# EasyEDA Pro project EasyEda.epro, schematic Schematic

## Sheets
1 Main: Board Name: General; Create Date: 2025-05-29; Page Name: Main; Project Name: TSC Tiwaz; Schematic Name: Schematic; Update Date: 2026-05-17; Company: TimoStrube.de; Drawn: Timo; Page Size: A4; Reviewed: Timo; Version: v1.3
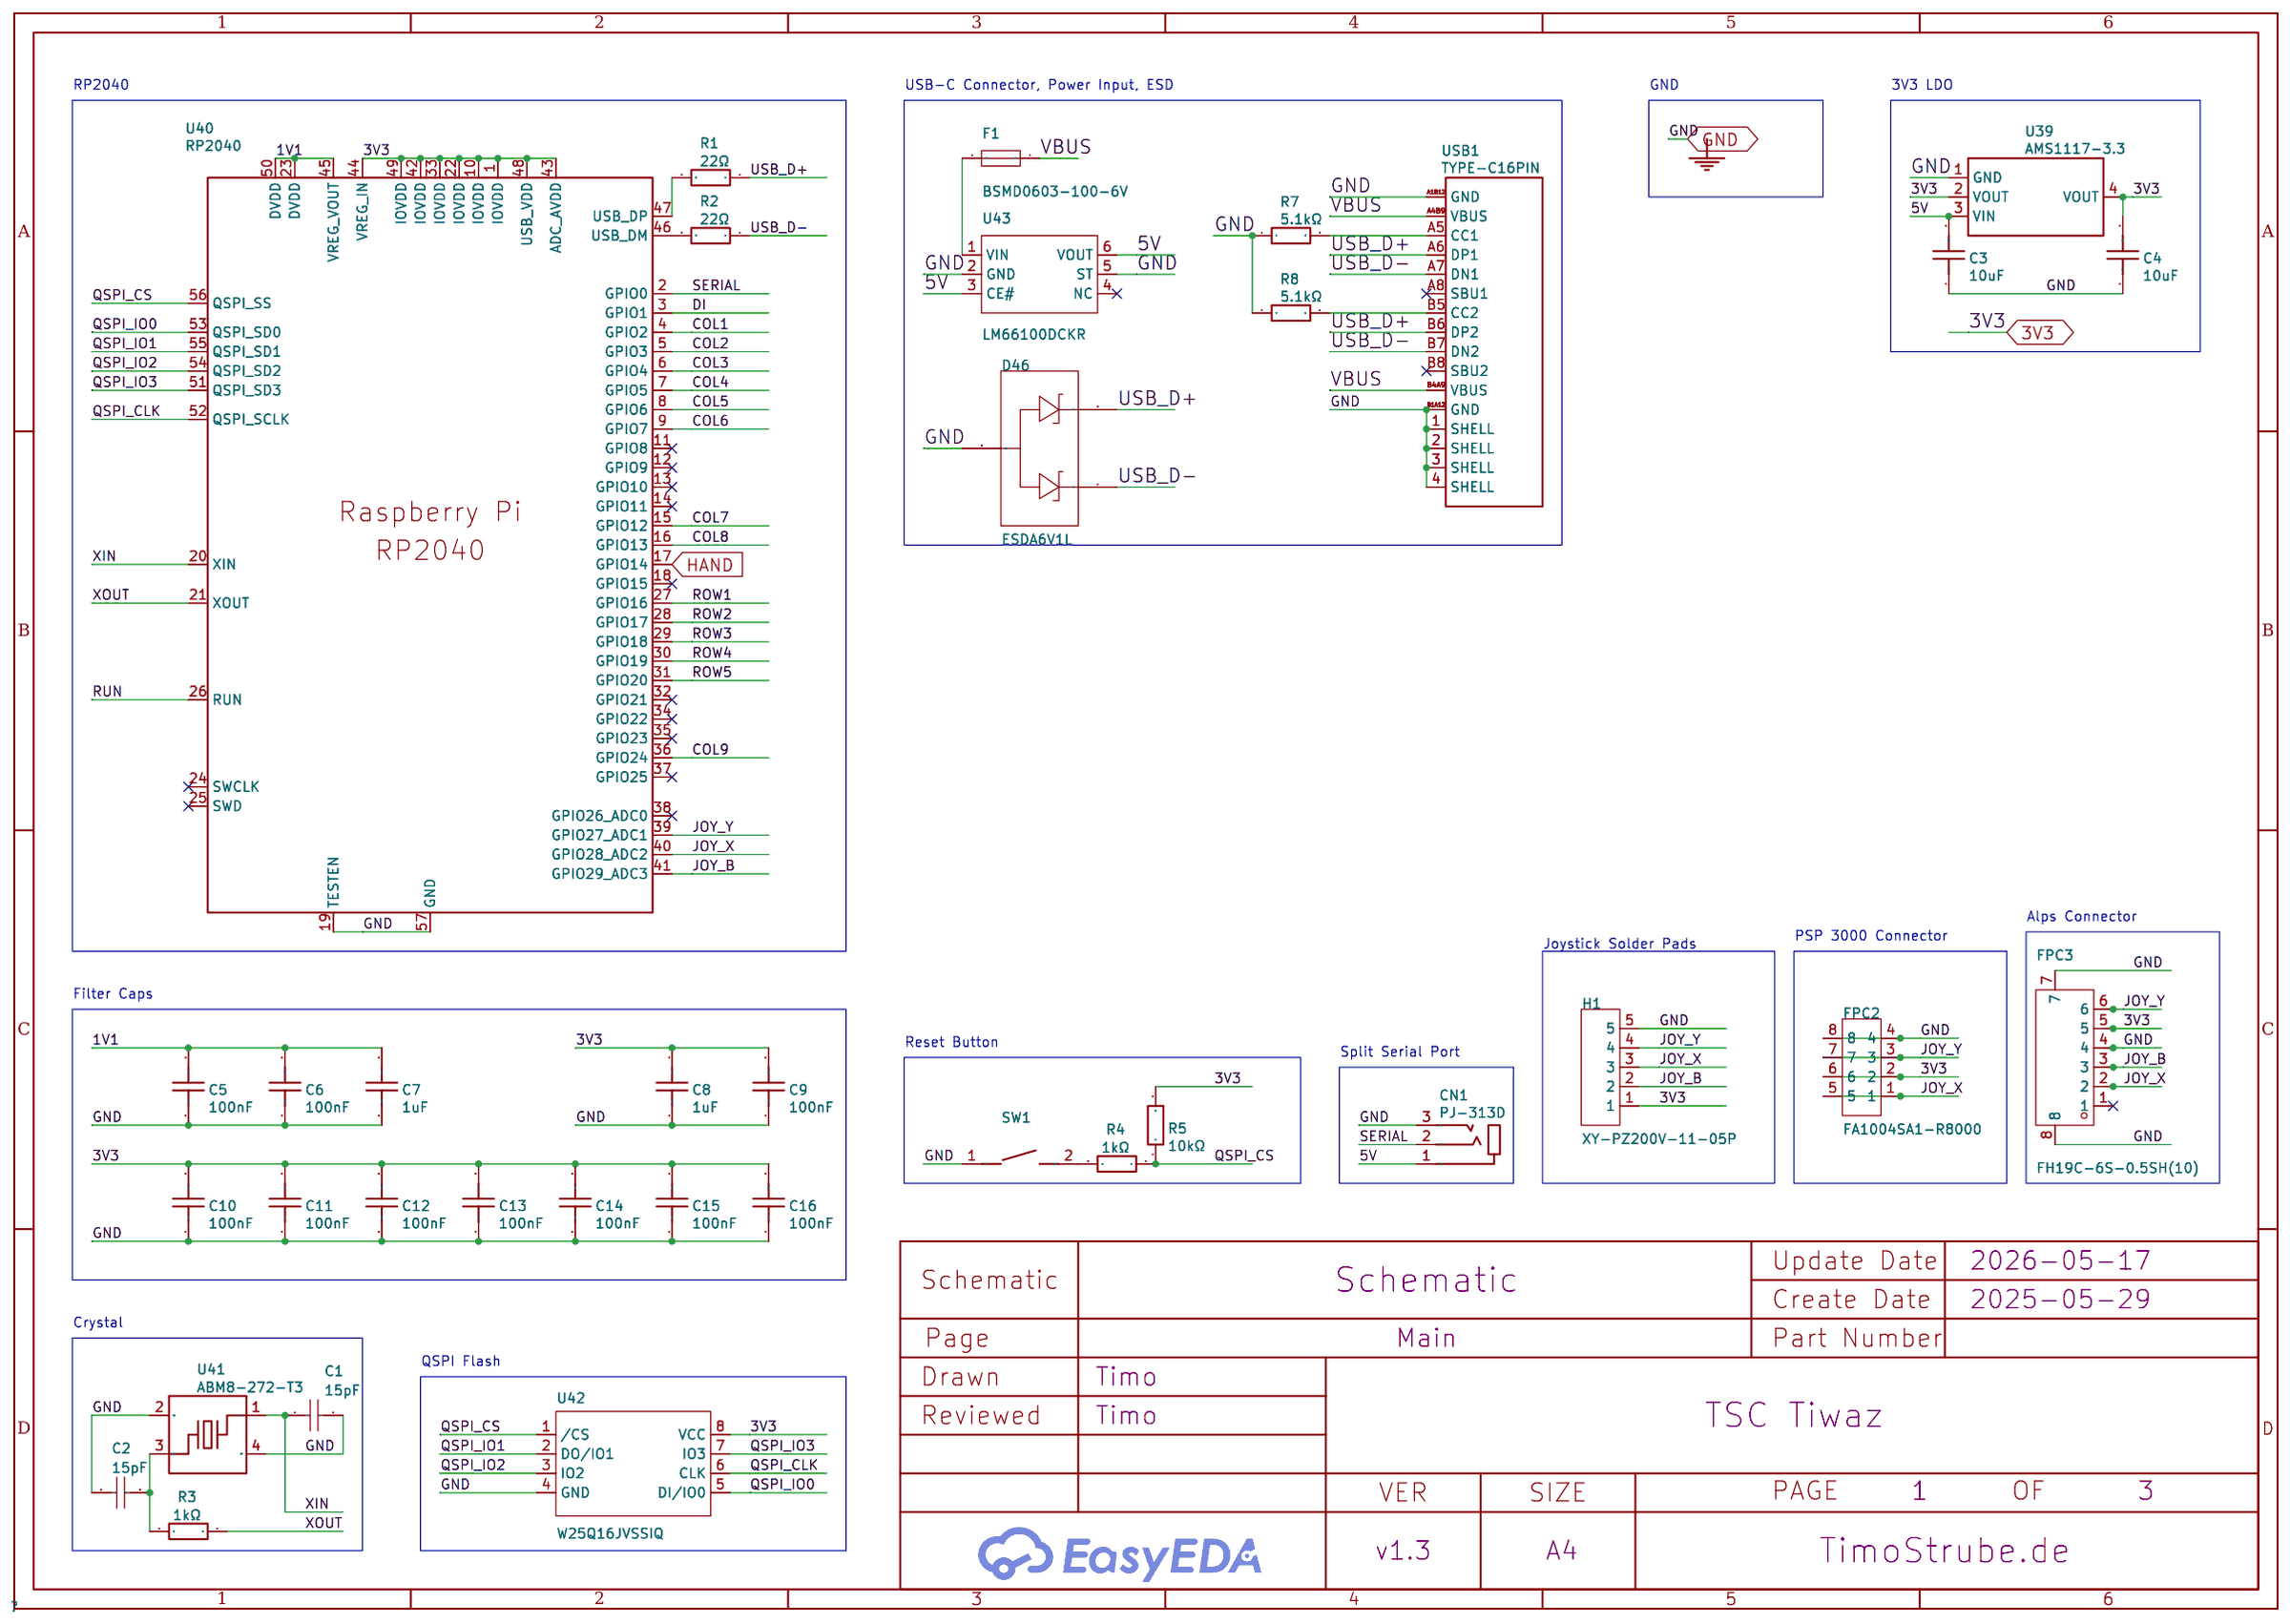
[diagram p2: Main]
2 LEDs: Create Date: 2025-06-02; Page Name: LEDs; Project Name: Splitto Dogu 2; Update Date: 2026-04-11
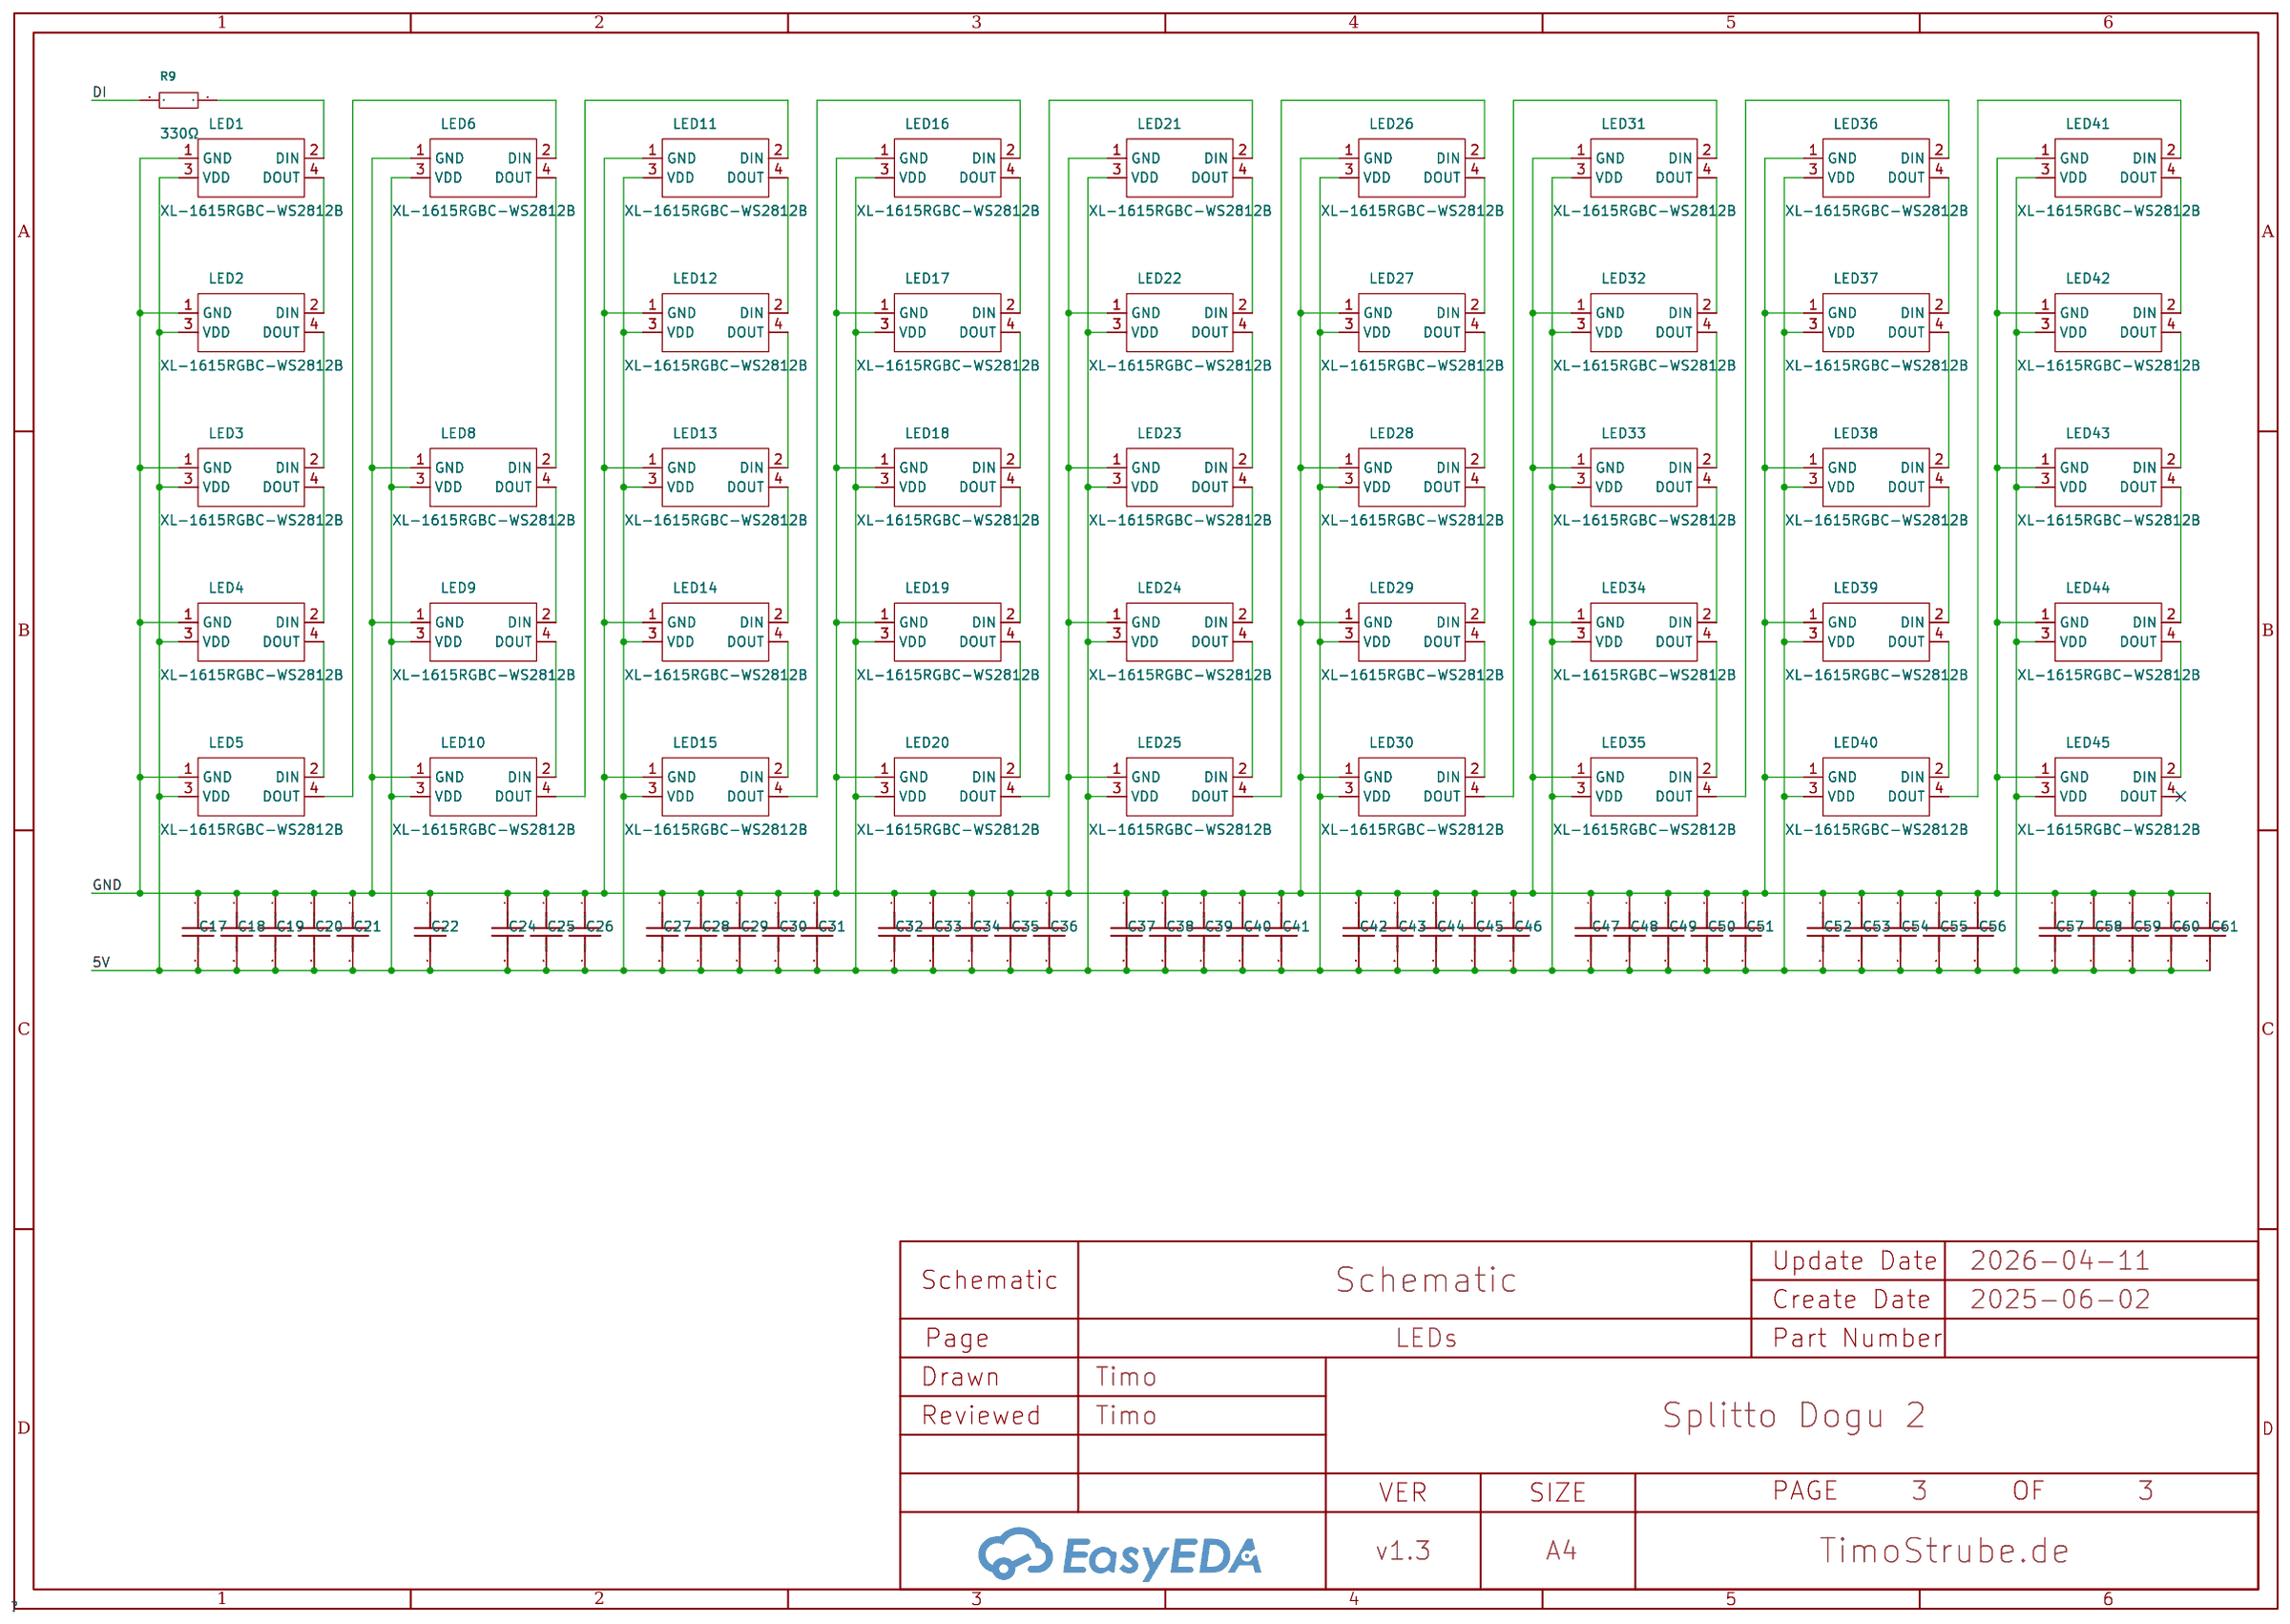
[diagram p3: LEDs]
3 Switches: Create Date: 2025-06-02; Page Name: Switches; Project Name: Splitto Dogu 2; Update Date: 2026-04-11
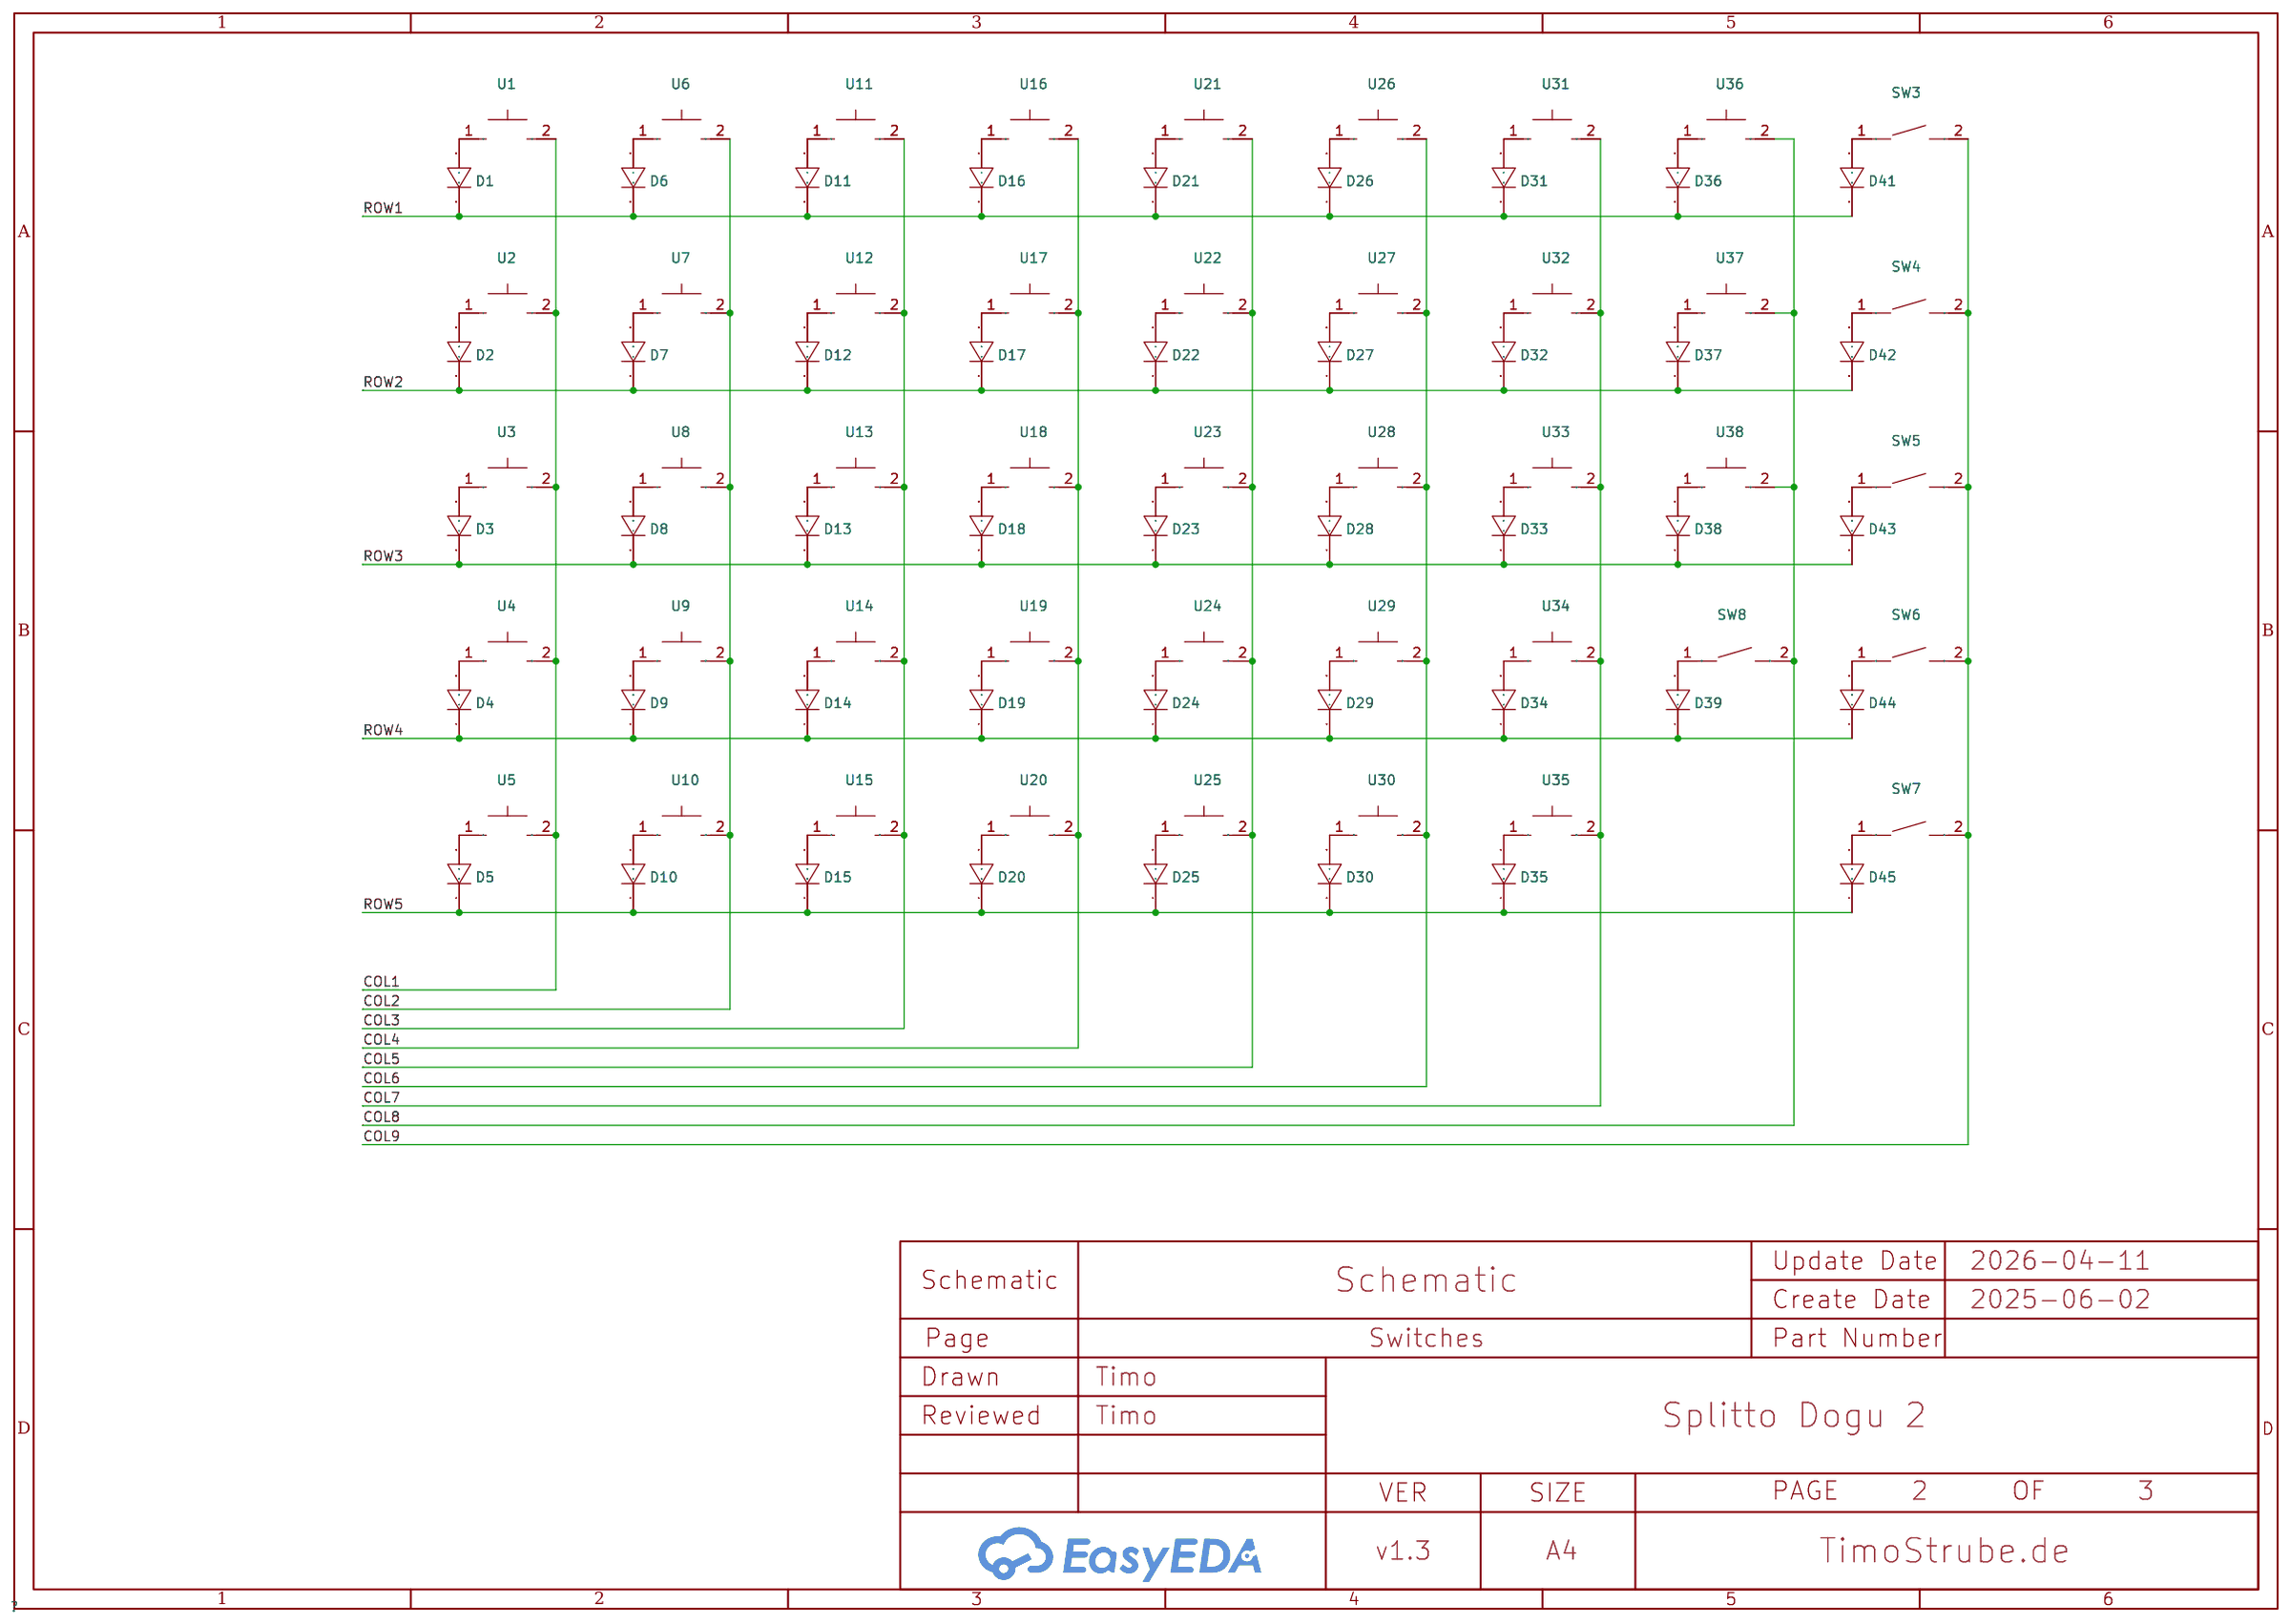
[diagram p4: Switches]

## Parts
sheet LEDs
C17  100nF  [C0402]
C18  100nF  [C0402]
C19  100nF  [C0402]
C20  100nF  [C0402]
C21  100nF  [C0402]
C22  100nF  [C0402]
C24  100nF  [C0402]
C25  100nF  [C0402]
C26  100nF  [C0402]
C27  100nF  [C0402]
C28  100nF  [C0402]
C29  100nF  [C0402]
C30  100nF  [C0402]
C31  100nF  [C0402]
C32  100nF  [C0402]
C33  100nF  [C0402]
C34  100nF  [C0402]
C35  100nF  [C0402]
C36  100nF  [C0402]
C37  100nF  [C0402]
C38  100nF  [C0402]
C39  100nF  [C0402]
C40  100nF  [C0402]
C41  100nF  [C0402]
C42  100nF  [C0402]
C43  100nF  [C0402]
C44  100nF  [C0402]
C45  100nF  [C0402]
C46  100nF  [C0402]
C47  100nF  [C0402]
C48  100nF  [C0402]
C49  100nF  [C0402]
C50  100nF  [C0402]
C51  100nF  [C0402]
C52  100nF  [C0402]
C53  100nF  [C0402]
C54  100nF  [C0402]
C55  100nF  [C0402]
C56  100nF  [C0402]
C57  100nF  [C0402]
C58  100nF  [C0402]
C59  100nF  [C0402]
C60  100nF  [C0402]
C61  100nF  [C0402]
LED1  XL-1615RGBC-WS2812B  [LED-SMD_4P-L1.6-W1.5_XL-1615RGBC-WS2812B-1]
LED2  XL-1615RGBC-WS2812B  [LED-SMD_4P-L1.6-W1.5_XL-1615RGBC-WS2812B-1]
LED3  XL-1615RGBC-WS2812B  [LED-SMD_4P-L1.6-W1.5_XL-1615RGBC-WS2812B-1]
LED4  XL-1615RGBC-WS2812B  [LED-SMD_4P-L1.6-W1.5_XL-1615RGBC-WS2812B-1]
LED5  XL-1615RGBC-WS2812B  [LED-SMD_4P-L1.6-W1.5_XL-1615RGBC-WS2812B-1]
LED6  XL-1615RGBC-WS2812B  [LED-SMD_4P-L1.6-W1.5_XL-1615RGBC-WS2812B-1]
LED8  XL-1615RGBC-WS2812B  [LED-SMD_4P-L1.6-W1.5_XL-1615RGBC-WS2812B-1]
LED9  XL-1615RGBC-WS2812B  [LED-SMD_4P-L1.6-W1.5_XL-1615RGBC-WS2812B-1]
LED10  XL-1615RGBC-WS2812B  [LED-SMD_4P-L1.6-W1.5_XL-1615RGBC-WS2812B-1]
LED11  XL-1615RGBC-WS2812B  [LED-SMD_4P-L1.6-W1.5_XL-1615RGBC-WS2812B-1]
LED12  XL-1615RGBC-WS2812B  [LED-SMD_4P-L1.6-W1.5_XL-1615RGBC-WS2812B-1]
LED13  XL-1615RGBC-WS2812B  [LED-SMD_4P-L1.6-W1.5_XL-1615RGBC-WS2812B-1]
LED14  XL-1615RGBC-WS2812B  [LED-SMD_4P-L1.6-W1.5_XL-1615RGBC-WS2812B-1]
LED15  XL-1615RGBC-WS2812B  [LED-SMD_4P-L1.6-W1.5_XL-1615RGBC-WS2812B-1]
LED16  XL-1615RGBC-WS2812B  [LED-SMD_4P-L1.6-W1.5_XL-1615RGBC-WS2812B-1]
LED17  XL-1615RGBC-WS2812B  [LED-SMD_4P-L1.6-W1.5_XL-1615RGBC-WS2812B-1]
LED18  XL-1615RGBC-WS2812B  [LED-SMD_4P-L1.6-W1.5_XL-1615RGBC-WS2812B-1]
LED19  XL-1615RGBC-WS2812B  [LED-SMD_4P-L1.6-W1.5_XL-1615RGBC-WS2812B-1]
LED20  XL-1615RGBC-WS2812B  [LED-SMD_4P-L1.6-W1.5_XL-1615RGBC-WS2812B-1]
LED21  XL-1615RGBC-WS2812B  [LED-SMD_4P-L1.6-W1.5_XL-1615RGBC-WS2812B-1]
LED22  XL-1615RGBC-WS2812B  [LED-SMD_4P-L1.6-W1.5_XL-1615RGBC-WS2812B-1]
LED23  XL-1615RGBC-WS2812B  [LED-SMD_4P-L1.6-W1.5_XL-1615RGBC-WS2812B-1]
LED24  XL-1615RGBC-WS2812B  [LED-SMD_4P-L1.6-W1.5_XL-1615RGBC-WS2812B-1]
LED25  XL-1615RGBC-WS2812B  [LED-SMD_4P-L1.6-W1.5_XL-1615RGBC-WS2812B-1]
LED26  XL-1615RGBC-WS2812B  [LED-SMD_4P-L1.6-W1.5_XL-1615RGBC-WS2812B-1]
LED27  XL-1615RGBC-WS2812B  [LED-SMD_4P-L1.6-W1.5_XL-1615RGBC-WS2812B-1]
LED28  XL-1615RGBC-WS2812B  [LED-SMD_4P-L1.6-W1.5_XL-1615RGBC-WS2812B-1]
LED29  XL-1615RGBC-WS2812B  [LED-SMD_4P-L1.6-W1.5_XL-1615RGBC-WS2812B-1]
LED30  XL-1615RGBC-WS2812B  [LED-SMD_4P-L1.6-W1.5_XL-1615RGBC-WS2812B-1]
LED31  XL-1615RGBC-WS2812B  [LED-SMD_4P-L1.6-W1.5_XL-1615RGBC-WS2812B-1]
LED32  XL-1615RGBC-WS2812B  [LED-SMD_4P-L1.6-W1.5_XL-1615RGBC-WS2812B-1]
LED33  XL-1615RGBC-WS2812B  [LED-SMD_4P-L1.6-W1.5_XL-1615RGBC-WS2812B-1]
LED34  XL-1615RGBC-WS2812B  [LED-SMD_4P-L1.6-W1.5_XL-1615RGBC-WS2812B-1]
LED35  XL-1615RGBC-WS2812B  [LED-SMD_4P-L1.6-W1.5_XL-1615RGBC-WS2812B-1]
LED36  XL-1615RGBC-WS2812B  [LED-SMD_4P-L1.6-W1.5_XL-1615RGBC-WS2812B-1]
LED37  XL-1615RGBC-WS2812B  [LED-SMD_4P-L1.6-W1.5_XL-1615RGBC-WS2812B-1]
LED38  XL-1615RGBC-WS2812B  [LED-SMD_4P-L1.6-W1.5_XL-1615RGBC-WS2812B-1]
LED39  XL-1615RGBC-WS2812B  [LED-SMD_4P-L1.6-W1.5_XL-1615RGBC-WS2812B-1]
LED40  XL-1615RGBC-WS2812B  [LED-SMD_4P-L1.6-W1.5_XL-1615RGBC-WS2812B-1]
LED41  XL-1615RGBC-WS2812B  [LED-SMD_4P-L1.6-W1.5_XL-1615RGBC-WS2812B-1]
LED42  XL-1615RGBC-WS2812B  [LED-SMD_4P-L1.6-W1.5_XL-1615RGBC-WS2812B-1]
LED43  XL-1615RGBC-WS2812B  [LED-SMD_4P-L1.6-W1.5_XL-1615RGBC-WS2812B-1]
LED44  XL-1615RGBC-WS2812B  [LED-SMD_4P-L1.6-W1.5_XL-1615RGBC-WS2812B-1]
LED45  XL-1615RGBC-WS2812B  [LED-SMD_4P-L1.6-W1.5_XL-1615RGBC-WS2812B-1]
R9  330Ω  [R0402]
sheet Main
C1  15pF  [C0402]
C2  15pF  [C0402]
C3  10uF  [C0603]
C4  10uF  [C0603]
C5  100nF  [C0402]
C6  100nF  [C0402]
C7  1uF  [C0402]
C8  1uF  [C0402]
C9  100nF  [C0402]
C10  100nF  [C0402]
C11  100nF  [C0402]
C12  100nF  [C0402]
C13  100nF  [C0402]
C14  100nF  [C0402]
C15  100nF  [C0402]
C16  100nF  [C0402]
CN1  PJ-313D  [AUDIO-SMD_PJ-313D-2]
D46  ESDA6V1L  [SOT-23-3_L3.0-W1.7-P0.95-LS2.9-BR]
F1  BSMD0603-100-6V  [F0603]
FPC2  FA1004SA1-R8000  [CONN-SMD_FA1004SA1-R8000]
FPC3  FH19C-6S-0.5SH(10)  [FPC-SMD_FH19C-6S-0.5SH]
H1  XY-PZ200V-11-05P  [HDR-TH_XY-PZ200V-11-05P]
R1  22Ω  [R0402]
R2  22Ω  [R0402]
R3  1kΩ  [R0402]
R4  1kΩ  [R0402]
R5  10kΩ  [R0402]
R7  5.1kΩ  [R0402]
R8  5.1kΩ  [R0402]
SW1  TS-1088-AR02016  [SW-SMD_L3.9-W3.0-P4.45]
U39  AMS1117-3.3  [SOT-223-3_L6.5-W3.4-P2.30-LS7.0-BR]
U40  RP2040  [LQFN-56_L7.0-W7.0-P0.4-EP]
U41  ABM8-272-T3  [CRYSTAL-SMD_4P-L3.2-W2.5-BL]
U42  W25Q16JVSSIQ  [SOIC-8_L5.3-W5.3-P1.27-LS8.0-BL]
U43  LM66100DCKR  [SC-70-6_L2.0-W1.3-P0.65-LS2.1-BL]
USB1  TYPE-C16PIN  [USB-C-SMD_TYPE-C16PIN]
sheet Switches
D1  1N4148WS  [SOD-323_L1.8-W1.3-LS2.5-RD]
D2  1N4148WS  [SOD-323_L1.8-W1.3-LS2.5-RD]
D3  1N4148WS  [SOD-323_L1.8-W1.3-LS2.5-RD]
D4  1N4148WS  [SOD-323_L1.8-W1.3-LS2.5-RD]
D5  1N4148WS  [SOD-323_L1.8-W1.3-LS2.5-RD]
D6  1N4148WS  [SOD-323_L1.8-W1.3-LS2.5-RD]
D7  1N4148WS  [SOD-323_L1.8-W1.3-LS2.5-RD]
D8  1N4148WS  [SOD-323_L1.8-W1.3-LS2.5-RD]
D9  1N4148WS  [SOD-323_L1.8-W1.3-LS2.5-RD]
D10  1N4148WS  [SOD-323_L1.8-W1.3-LS2.5-RD]
D11  1N4148WS  [SOD-323_L1.8-W1.3-LS2.5-RD]
D12  1N4148WS  [SOD-323_L1.8-W1.3-LS2.5-RD]
D13  1N4148WS  [SOD-323_L1.8-W1.3-LS2.5-RD]
D14  1N4148WS  [SOD-323_L1.8-W1.3-LS2.5-RD]
D15  1N4148WS  [SOD-323_L1.8-W1.3-LS2.5-RD]
D16  1N4148WS  [SOD-323_L1.8-W1.3-LS2.5-RD]
D17  1N4148WS  [SOD-323_L1.8-W1.3-LS2.5-RD]
D18  1N4148WS  [SOD-323_L1.8-W1.3-LS2.5-RD]
D19  1N4148WS  [SOD-323_L1.8-W1.3-LS2.5-RD]
D20  1N4148WS  [SOD-323_L1.8-W1.3-LS2.5-RD]
D21  1N4148WS  [SOD-323_L1.8-W1.3-LS2.5-RD]
D22  1N4148WS  [SOD-323_L1.8-W1.3-LS2.5-RD]
D23  1N4148WS  [SOD-323_L1.8-W1.3-LS2.5-RD]
D24  1N4148WS  [SOD-323_L1.8-W1.3-LS2.5-RD]
D25  1N4148WS  [SOD-323_L1.8-W1.3-LS2.5-RD]
D26  1N4148WS  [SOD-323_L1.8-W1.3-LS2.5-RD]
D27  1N4148WS  [SOD-323_L1.8-W1.3-LS2.5-RD]
D28  1N4148WS  [SOD-323_L1.8-W1.3-LS2.5-RD]
D29  1N4148WS  [SOD-323_L1.8-W1.3-LS2.5-RD]
D30  1N4148WS  [SOD-323_L1.8-W1.3-LS2.5-RD]
D31  1N4148WS  [SOD-323_L1.8-W1.3-LS2.5-RD]
D32  1N4148WS  [SOD-323_L1.8-W1.3-LS2.5-RD]
D33  1N4148WS  [SOD-323_L1.8-W1.3-LS2.5-RD]
D34  1N4148WS  [SOD-323_L1.8-W1.3-LS2.5-RD]
D35  1N4148WS  [SOD-323_L1.8-W1.3-LS2.5-RD]
D36  1N4148WS  [SOD-323_L1.8-W1.3-LS2.5-RD]
D37  1N4148WS  [SOD-323_L1.8-W1.3-LS2.5-RD]
D38  1N4148WS  [SOD-323_L1.8-W1.3-LS2.5-RD]
D39  1N4148WS  [SOD-323_L1.8-W1.3-LS2.5-RD]
D41  1N4148WS  [SOD-323_L1.8-W1.3-LS2.5-RD]
D42  1N4148WS  [SOD-323_L1.8-W1.3-LS2.5-RD]
D43  1N4148WS  [SOD-323_L1.8-W1.3-LS2.5-RD]
D44  1N4148WS  [SOD-323_L1.8-W1.3-LS2.5-RD]
D45  1N4148WS  [SOD-323_L1.8-W1.3-LS2.5-RD]
SW3  TS-1088-AR02016  [SW-SMD_L3.9-W3.0-P4.45]
SW4  TS-1088-AR02016  [SW-SMD_L3.9-W3.0-P4.45]
SW5  TS-1088-AR02016  [SW-SMD_L3.9-W3.0-P4.45]
SW6  TS-1088-AR02016  [SW-SMD_L3.9-W3.0-P4.45]
SW7  TS-1088-AR02016  [SW-SMD_L3.9-W3.0-P4.45]
SW8  TS-1088-AR02016  [SW-SMD_L3.9-W3.0-P4.45]
U1  CPG151101S11-16  [SMD_KEYBOARD-SW_COMPLETE]
U2  CPG151101S11-16  [SMD_KEYBOARD-SW_COMPLETE]
U3  CPG151101S11-16  [SMD_KEYBOARD-SW_COMPLETE]
U4  CPG151101S11-16  [SMD_KEYBOARD-SW_COMPLETE]
U5  CPG151101S11-16  [SMD_KEYBOARD-SW_COMPLETE]
U6  CPG151101S11-16  [SMD_KEYBOARD-SW_COMPLETE]
U7  CPG151101S11-16  [SMD_KEYBOARD-SW_COMPLETE]
U8  CPG151101S11-16  [SMD_KEYBOARD-SW_COMPLETE]
U9  CPG151101S11-16  [SMD_KEYBOARD-SW_COMPLETE]
U10  CPG151101S11-16  [SMD_KEYBOARD-SW_COMPLETE]
U11  CPG151101S11-16  [SMD_KEYBOARD-SW_COMPLETE]
U12  CPG151101S11-16  [SMD_KEYBOARD-SW_COMPLETE]
U13  CPG151101S11-16  [SMD_KEYBOARD-SW_COMPLETE]
U14  CPG151101S11-16  [SMD_KEYBOARD-SW_COMPLETE]
U15  CPG151101S11-16  [SMD_KEYBOARD-SW_COMPLETE]
U16  CPG151101S11-16  [SMD_KEYBOARD-SW_COMPLETE]
U17  CPG151101S11-16  [SMD_KEYBOARD-SW_COMPLETE]
U18  CPG151101S11-16  [SMD_KEYBOARD-SW_COMPLETE]
U19  CPG151101S11-16  [SMD_KEYBOARD-SW_COMPLETE]
U20  CPG151101S11-16  [SMD_KEYBOARD-SW_COMPLETE]
U21  CPG151101S11-16  [SMD_KEYBOARD-SW_COMPLETE]
U22  CPG151101S11-16  [SMD_KEYBOARD-SW_COMPLETE]
U23  CPG151101S11-16  [SMD_KEYBOARD-SW_COMPLETE]
U24  CPG151101S11-16  [SMD_KEYBOARD-SW_COMPLETE]
U25  CPG151101S11-16  [SMD_KEYBOARD-SW_COMPLETE]
U26  CPG151101S11-16  [SMD_KEYBOARD-SW_COMPLETE]
U27  CPG151101S11-16  [SMD_KEYBOARD-SW_COMPLETE]
U28  CPG151101S11-16  [SMD_KEYBOARD-SW_COMPLETE]
U29  CPG151101S11-16  [SMD_KEYBOARD-SW_COMPLETE]
U30  CPG151101S11-16  [SMD_KEYBOARD-SW_COMPLETE]
U31  CPG151101S11-16  [SMD_KEYBOARD-SW_COMPLETE]
U32  CPG151101S11-16  [SMD_KEYBOARD-SW_COMPLETE]
U33  CPG151101S11-16  [SMD_KEYBOARD-SW_COMPLETE]
U34  CPG151101S11-16  [SMD_KEYBOARD-SW_COMPLETE]
U35  CPG151101S11-16  [SMD_KEYBOARD-SW_COMPLETE]
U36  CPG151101S11-16  [SMD_KEYBOARD-SW_COMPLETE]
U37  CPG151101S11-16  [SMD_KEYBOARD-SW_COMPLETE]
U38  CPG151101S11-16  [SMD_KEYBOARD-SW_COMPLETE]

## Library data of the parts
C5 C6 C9-C22 C24-C61 = 100nF: Supplier: LCSC; Manufacturer: SAMSUNG(三星); Manufacturer Part: CL05B104KO5NNNC; Supplier Part: C1525; JLCPCB Part Class: Basic Part; nameAlias: Value; spicePre: C; spiceSymbolName: CL05B104KO5NNNC
LED1-LED6 LED8-LED45 = XL-1615RGBC-WS2812B: Wavelength:620nm~625nm；525nm~530nm；465nm~470nm Luminous Intensity:360mcd；110mcd；130mcd Lens Color:Colorless Transparent Lens Installation method:Positive Stick Operating Temperature:-20℃~+85℃; LCSC Part Name: 幻彩透明 XL-1615RGBC-WS2812B; Supplier Part: C5349954; Manufacturer: XINGLIGHT(成兴光); Supplier Footprint: SMD-4P,1.6x1.5mm; JLCPCB Part Class: Extended Part; Datasheet: https://atta.szlcsc.com/upload/public/pdf/source/20250225/67A3F398505C98A70638B14BC571D0AB.pdf; Supplier: LCSC; Wavelength: 620nm~625nm；525nm~530nm；465nm~470nm; Luminous Intensity: 360mcd；110mcd；130mcd; Lens Color: Colorless Transparent Lens; Installation method: Positive Stick; Operating Temperature: -20℃~+85℃
R9 = 0402WGF3300TCE: Type:Thick Film Resistors Resistance:330Ω Tolerance:±1% Tolerance:±1% Power(Watts):1/16W Voltage-Supply(Max):50V Temperature Coefficient:±100ppm/℃ Temperature Coefficient:±100ppm/℃ Operating Temperature:-55℃~+155℃ Operating Temperature:-55℃~+155℃; LCSC Part Name: 330Ω ±1% 62.5mW 厚膜电阻; Supplier Part: C25104; Manufacturer: UNI-ROYAL(厚声); Supplier Footprint: 0402; JLCPCB Part Class: Basic Part; Datasheet: https://atta.szlcsc.com/upload/public/pdf/source/20200306/C422600_1E6D84923E4A46A82E41ADD87F860B5C.pdf; Supplier: LCSC; Type: Thick Film Resistors; Tolerance: ±1%; Power(Watts): 1/16W; Voltage-Supply(Max): 50V; Temperature Coefficient: ±100ppm/℃; Operating Temperature: -55℃~+155℃
C1 C2 = 0402CG150J500NT: Capacitance:15pF Tolerance:±5% Tolerance:±5% Voltage Rating:50V Temperature Coefficient:C0G; LCSC Part Name: 15pF ±5% 50V; Supplier Part: C1548; Manufacturer: FH(风华); Supplier Footprint: 0402; JLCPCB Part Class: Basic Part; Datasheet: https://item.szlcsc.com/datasheet/0402CG150J500NT/1900.html; Supplier: LCSC; Tolerance: ±5%; Voltage Rating: 50V; Temperature Coefficient: C0G
C3 C4 = 10uF: Supplier: LCSC; Manufacturer: SAMSUNG(三星); Manufacturer Part: CL10A106KP8NNNC; Supplier Part: C19702; JLCPCB Part Class: Basic Part; nameAlias: Value; spicePre: C; spiceSymbolName: CL10A106KP8NNNC
C7 C8 = 1uF: Supplier: LCSC; Manufacturer: SAMSUNG(三星); Manufacturer Part: CL05A105KA5NQNC; Supplier Part: C52923; JLCPCB Part Class: Basic Part; nameAlias: Value; spicePre: C; spiceSymbolName: CL05A105KA5NQNC
CN1 = PJ-313D: Supplier: LCSC; Supplier Part: C668608; Manufacturer: SHOU HAN(首韩); JLCPCB Part Class: Extended Part; Contributor: LCSC; spicePre: C; spiceSymbolName: PJ-313D_C668608
D46 = ESDA6V1L_C24378: Polarity:Unidirectional Reverse Stand-Off Voltage (Vrwm):5.25V Clamping Voltage:6.1V Peak Pulse Power Dissipation (Ppp):300W@8/20us Voltage - Breakdown:7.2V Reverse Leakage Current (Ir):20uA Number of Channels:2 Operating Temperature:-40℃~+125℃ Operating; Supplier Part: C24378; Manufacturer: ST(意法半导体); Supplier Footprint: SOT-23; JLCPCB Part Class: Extended Part; Datasheet: https://item.szlcsc.com/datasheet/ESDA6V1L/25118.html; Supplier: LCSC; Polarity: Unidirectional; Reverse Stand-Off Voltage (Vrwm): 5.25V; Clamping Voltage: 6.1V; Peak Pulse Power Dissipation (Ppp): 300W@8/20us; Voltage - Breakdown: 7.2V; Reverse Leakage Current (Ir): 20uA; Number of Channels: 2; Operating Temperature: -40℃~+125℃; level of protection: IEC 61000-4-2; Type: ESD; Junction Capacitance: 140pF
F1 = BSMD0603-100-6V: Voltage - Max:6V Current - Max:40A Hold Current:1A Trip Current:2A Power Dissipation:0.5W Resistance - Initial (Ri) (Min):50mΩ Resistance - Post Trip (R1) (Max):300mΩ Time to Trip(Max):100ms Operating Temperature:-40℃~+85℃ Operating Temperature:-40℃~+85℃; LCSC Part Name: 6V 1A 0603自恢复; Supplier Part: C18203128; Manufacturer: BHFUSE(佰宏); Supplier Footprint: 0603; JLCPCB Part Class: Extended Part; Datasheet: https://atta.szlcsc.com/upload/public/pdf/source/20230927/1AC9053D09F245F758CE7AC1942F788A.pdf; Supplier: LCSC; Voltage - Max: 6V; Current - Max: 40A; Hold Current: 1A; Trip Current: 2A; Power Dissipation: 0.5W; Resistance - Initial (Ri) (Min): 50mΩ; Resistance - Post Trip (R1) (Max): 300mΩ; Time to Trip(Max): 100ms; Operating Temperature: -40℃~+85℃
FPC2 = FA1004SA1-R8000: Contact Type:Double-Sided Contacts, Top and Bottom Entry Number of Contacts:4P Pitch:0.5mm Mounting Type:Surface Mount, Right Angle FFC, FCB Thickness:0.2mm FFC, FCB Thickness:0.2mm Height Above Board:0.88mm Contact Material:Copper Alloy Contact Plating:G; LCSC Part Name: 间距:0.5mm P数:4P 双侧触点/上下接; Supplier Part: C6853347; Manufacturer: JAE(日本航空电子); Supplier Footprint: SMD,P=0.5mm,卧贴; JLCPCB Part Class: Extended Part; Supplier: LCSC; Contact Type: Double-Sided Contacts, Top and Bottom Entry; Number of Contacts: 4P; Pitch: 0.5mm; Mounting Type: Surface Mount, Right Angle; FFC, FCB Thickness: 0.2mm; Height Above Board: 0.88mm; Contact Material: Copper Alloy; Contact Plating: Gold; Operating Temperature: -40℃~+85℃
FPC3 = FH19C-6S-0.5SH(10): Locking Feature:Hinged Lid Contact Type:Bottom Contact Number of Contacts:6P Pitch:0.5mm Mounting Type:Surface Mount, Right Angle FFC, FCB Thickness:0.2mm FFC, FCB Thickness:0.2mm Height Above Board:0.88mm Contact Material:Phosphor Bronze Contact Plating:; LCSC Part Name: 间距:0.5mm P数:6P 翻盖式 下接; Supplier Part: C424651; Manufacturer: HRS(广濑); Supplier Footprint: SMD,P=0.5mm,卧贴; JLCPCB Part Class: Extended Part; Datasheet: https://item.szlcsc.com/datasheet/FH19C-6S-0.5SH(10)/418168.html; Supplier: LCSC; Locking Feature: Hinged Lid; Contact Type: Bottom Contact; Number of Contacts: 6P; Pitch: 0.5mm; Mounting Type: Surface Mount, Right Angle; FFC, FCB Thickness: 0.2mm; Height Above Board: 0.88mm; Contact Material: Phosphor Bronze; Contact Plating: Gold; Operating Temperature: -55℃~+85℃
H1 = XY-PZ200V-11-05P: Pin Structure:1x5P Pitch:2mm Circluar Pins/Square Pins:Pin Header Mounting Type:Through Hole Number of Rows:1 Number of Pins:5P Current Rating:1.5A Length of Mating Pin:3.9mm Insulation Height:2mm Length of End Connection Pin:2.8mm Contact Material:Brass; LCSC Part Name: 1x5P 间距:2mm 方针 直插; Supplier Part: C53200672; Manufacturer: XYECONN(辛译); Supplier Footprint: 插件,P=2mm; JLCPCB Part Class: Extended Part; Datasheet: https://item.szlcsc.com/datasheet/XY-PZ200V-11-05P/56228052.html; Supplier: LCSC; Pin Structure: 1x5P; Pitch: 2mm; Circluar Pins/Square Pins: Pin Header; Mounting Type: Through Hole; Number of Rows: 1; Number of Pins: 5P; Current Rating: 1.5A; Length of Mating Pin: 3.9mm; Insulation Height: 2mm; Length of End Connection Pin: 2.8mm; Contact Material: Brass; Contact Plating: Gold; Operating Temperature: -40℃~+105℃; Color: Black
R1 R2 = 22Ω: Supplier: LCSC; Manufacturer: UNI-ROYAL(厚声); Manufacturer Part: 0402WGF220JTCE; Supplier Part: C25092; JLCPCB Part Class: Basic Part; nameAlias: Value; spicePre: R; spiceSymbolName: 0402WGF220JTCE
R3 R4 = 1kΩ: Supplier: LCSC; Manufacturer: UNI-ROYAL(厚声); Manufacturer Part: 0402WGF1001TCE; Supplier Part: C11702; JLCPCB Part Class: Basic Part; nameAlias: Value; spicePre: R; spiceSymbolName: 0402WGF1001TCE
R5 = 10kΩ: Supplier: LCSC; Manufacturer: UNI-ROYAL(厚声); Manufacturer Part: 0402WGF1002TCE; Supplier Part: C25744; JLCPCB Part Class: Basic Part; nameAlias: Value; spicePre: R; spiceSymbolName: 0402WGF1002TCE
R7 R8 = 5.1kΩ: Supplier: LCSC; Manufacturer: UNI-ROYAL(厚声); Manufacturer Part: 0402WGF5101TCE; Supplier Part: C25905; JLCPCB Part Class: Basic Part; nameAlias: Value; spicePre: R; spiceSymbolName: 0402WGF5101TCE
SW1 SW3-SW8 = TS-1088-AR02016: Circuit:SPST Actuator Style:Round Button Operating Force:160gf Mounting Style:Brick nogging Switch Length:4mm Switch Width:3mm Switch Height:2mm Strike Gundam:不带 Contact Current:50mA Voltage Rating (DC):12V Insulation Resistance:100MΩ Actuator/Cap Color:B; LCSC Part Name: 4*3*2mm 立贴 轻触开关; Supplier Part: C720477; Manufacturer: XUNPU(讯普); Supplier Footprint: SMD; JLCPCB Part Class: Basic Part; Datasheet: https://atta.szlcsc.com/upload/public/pdf/source/20200810/C720475_60D09DD6C54279ADDB2DC25100F1CC11.pdf; Supplier: LCSC; Circuit: SPST; Actuator Style: Round Button; Operating Force: 160gf; Mounting Style: Brick nogging; Switch Length: 4mm; Switch Width: 3mm; Switch Height: 2mm; Strike Gundam: 不带; Contact Current: 50mA; Voltage Rating (DC): 12V; Insulation Resistance: 100MΩ; Actuator/Cap Color: Black; Pin Style: SMDSplicing; Mechanical Life: 10万次; Operating Temperature: -30℃~+80℃
U39 = AMS1117-3.3: Supplier: LCSC; Manufacturer: AMS; Supplier Part: C6186; JLCPCB Part Class: Basic Part; sourceId: dwIGgezVh; timeStamp: 1476261164; spicePre: U
U40 = RP2040: Supplier: LCSC; Supplier Part: C2040; Manufacturer: Raspberry Pi(树莓派); JLCPCB Part Class: Extended Part; Contributor: LCSC; spicePre: U
U41 = ABM8-272-T3: Supplier: LCSC; Supplier Part: C20625731; Manufacturer: ABRACON; JLCPCB Part Class: Extended Part; Contributor: lcsc; spicePre: U; spiceSymbolName: ABM8-272-T3_C20625731
U42 = W25Q16JVSSIQ: Interface:SPI Memory Size:16Mbit Clock Frequency:133MHz Voltage - Supply:2.7V~3.6V Voltage - Supply:2.7V~3.6V Standby Supply Current:10uA Program / Erase Cycles:100,000 Cycles Page Programming Time (Tpp):3ms Data Retention - TDR (Year):20 Years Operating; LCSC Part Name: 支持双/四路SPI接口的3V、16Mbit 串行闪存; Supplier Part: C131025; Manufacturer: Winbond(华邦); Supplier Footprint: SOIC-8-208mil; JLCPCB Part Class: Extended Part; Datasheet: https://item.szlcsc.com/datasheet/W25Q16JVSSIQ/142317.html; Supplier: LCSC; Interface: SPI; Memory Size: 16Mbit; Clock Frequency: 133MHz; Voltage - Supply: 2.7V~3.6V; Standby Supply Current: 10uA; Program / Erase Cycles: 100,000 Cycles; Page Programming Time (Tpp): 3ms; Data Retention - TDR (Year): 20 Years; Operating Temperature: -40℃~+85℃
U43 = LM66100DCKR_C2869734: LCSC Part Name: 5.5V 1.5A 低静态电流理想二极管; Supplier Part: C2869734; Manufacturer: TI(德州仪器); Supplier Footprint: SC-70-6; JLCPCB Part Class: Extended Part; Datasheet: https://www.ti.com/cn/lit/gpn/lm66100; Supplier: LCSC
USB1 = TYPE-C16PIN: Supplier: LCSC; Supplier Part: C393939; Manufacturer: SHOU HAN(首韩); JLCPCB Part Class: Extended Part; Contributor: LCSC; spicePre: U
D1-D39 D41-D45 = 1N4148WS_C2128: Diode Configuration:Independent Type Voltage - Forward(Vf@If):1.25V@150mA Voltage - DC Reverse(Vr):100V Current - Rectified:150mA Reverse Leakage Current (Ir):1uA@75V Reverse Recovery Time (trr):4ns Operating Temperature:- Operating Temperature:-; LCSC Part Name: 丝印T4 1N4148WS; Supplier Part: C2128; Manufacturer: CJ(江苏长电/长晶); Supplier Footprint: SOD-323; JLCPCB Part Class: Basic Part; Datasheet: https://atta.szlcsc.com/upload/public/pdf/source/20140809/1457707208178.pdf; Supplier: LCSC; Diode Configuration: Independent Type; Voltage - Forward(Vf@If): 1.25V@150mA; Voltage - DC Reverse(Vr): 100V; Current - Rectified: 150mA; Reverse Leakage Current (Ir): 1uA@75V; Reverse Recovery Time (trr): 4ns
U1-U38 = CPG151101S11-16_C41430893: LCSC Part Name: 热插拔底座连接器 键盘配件; Supplier Part: C41430893; Manufacturer: HanElectricity(瀚源); Supplier Footprint: SMD,14.5x5.9mm; JLCPCB Part Class: Extended Part; Datasheet: https://atta.szlcsc.com/upload/public/pdf/source/20241016/CAB9C3DABBAD4306660C041376EEF732.pdf; Supplier: LCSC

## Nets
1V1: C5.2 C6.2 C7.2 U40.23(DVDD) U40.45(VREG_VOUT) U40.50(DVDD)
3V3: C4.2 C8.1 C9.2 C10.2 C11.2 C12.2 C13.2 C14.2 C15.2 C16.2 FPC2.2 FPC2.6 FPC3.5 H1.1 R5.2 U39.2(VOUT) U39.4(VOUT) U40.1(IOVDD) U40.10(IOVDD) U40.22(IOVDD) U40.33(IOVDD) U40.42(IOVDD) U40.43(ADC_AVDD) U40.44(VREG_IN) U40.48(USB_VDD) U40.49(IOVDD) U42.8(VCC)
5V: C3.2 C17.2 C18.2 C19.2 C20.2 C21.2 C22.2 C24.2 C25.2 C26.2 C27.2 C28.2 C29.2 C30.2 C31.2 C32.2 C33.2 C34.2 C35.2 C36.2 C37.2 C38.2 C39.2 C40.2 C41.2 C42.2 C43.2 C44.2 C45.2 C46.2 C47.2 C48.2 C49.2 C50.2 C51.2 C52.2 C53.2 C54.2 C55.2 C56.2 C57.2 C58.2 C59.2 C60.2 C61.2 CN1.1 LED1.3(VDD) LED2.3(VDD) LED3.3(VDD) LED4.3(VDD) LED5.3(VDD) LED6.3(VDD) LED8.3(VDD) LED9.3(VDD) LED10.3(VDD) LED11.3(VDD) LED12.3(VDD) LED13.3(VDD) LED14.3(VDD) LED15.3(VDD) LED16.3(VDD) LED17.3(VDD) LED18.3(VDD) LED19.3(VDD) LED20.3(VDD) LED21.3(VDD) LED22.3(VDD) LED23.3(VDD) LED24.3(VDD) LED25.3(VDD) LED26.3(VDD) LED27.3(VDD) LED28.3(VDD) LED29.3(VDD) LED30.3(VDD) LED31.3(VDD) LED32.3(VDD) LED33.3(VDD) LED34.3(VDD) LED35.3(VDD) LED36.3(VDD) LED37.3(VDD) LED38.3(VDD) LED39.3(VDD) LED40.3(VDD) LED41.3(VDD) LED42.3(VDD) LED43.3(VDD) LED44.3(VDD) LED45.3(VDD) U39.3(VIN) U43.3(CE#) U43.6(VOUT)
GND: C1.2 C2.1 C3.1 C4.1 C5.1 C6.1 C7.1 C8.2 C9.1 C10.1 C11.1 C12.1 C13.1 C14.1 C15.1 C16.1 C17.1 C18.1 C19.1 C20.1 C21.1 C22.1 C24.1 C25.1 C26.1 C27.1 C28.1 C29.1 C30.1 C31.1 C32.1 C33.1 C34.1 C35.1 C36.1 C37.1 C38.1 C39.1 C40.1 C41.1 C42.1 C43.1 C44.1 C45.1 C46.1 C47.1 C48.1 C49.1 C50.1 C51.1 C52.1 C53.1 C54.1 C55.1 C56.1 C57.1 C58.1 C59.1 C60.1 C61.1 CN1.3 D46.3 FPC2.4 FPC2.8 FPC3.4 FPC3.7 FPC3.8 H1.5 LED1.1(GND) LED2.1(GND) LED3.1(GND) LED4.1(GND) LED5.1(GND) LED6.1(GND) LED8.1(GND) LED9.1(GND) LED10.1(GND) LED11.1(GND) LED12.1(GND) LED13.1(GND) LED14.1(GND) LED15.1(GND) LED16.1(GND) LED17.1(GND) LED18.1(GND) LED19.1(GND) LED20.1(GND) LED21.1(GND) LED22.1(GND) LED23.1(GND) LED24.1(GND) LED25.1(GND) LED26.1(GND) LED27.1(GND) LED28.1(GND) LED29.1(GND) LED30.1(GND) LED31.1(GND) LED32.1(GND) LED33.1(GND) LED34.1(GND) LED35.1(GND) LED36.1(GND) LED37.1(GND) LED38.1(GND) LED39.1(GND) LED40.1(GND) LED41.1(GND) LED42.1(GND) LED43.1(GND) LED44.1(GND) LED45.1(GND) R7.1 R8.1 SW1.1 U39.1(GND) U40.19(TESTEN) U40.57(GND) U41.2(GND) U41.4(GND) U42.4(GND) U43.2(GND) U43.5(ST) USB1.1(SHELL) USB1.2(SHELL) USB1.3(SHELL) USB1.4(SHELL) USB1.A1B12(GND) USB1.B1A12(GND)
VBUS: F1.1 USB1.A4B9(VBUS) USB1.B4A9(VBUS)
COL1: U1.2 U2.2 U3.2 U4.2 U5.2 U40.4(GPIO2)
COL2: U6.2 U7.2 U8.2 U9.2 U10.2 U40.5(GPIO3)
COL3: U11.2 U12.2 U13.2 U14.2 U15.2 U40.6(GPIO4)
COL4: U16.2 U17.2 U18.2 U19.2 U20.2 U40.7(GPIO5)
COL5: U21.2 U22.2 U23.2 U24.2 U25.2 U40.8(GPIO6)
COL6: U26.2 U27.2 U28.2 U29.2 U30.2 U40.9(GPIO7)
COL7: U31.2 U32.2 U33.2 U34.2 U35.2 U40.15(GPIO12)
COL8: SW8.2 U36.2 U37.2 U38.2 U40.16(GPIO13)
COL9: SW3.2 SW4.2 SW5.2 SW6.2 SW7.2 U40.36(GPIO24)
DI: R9.2 U40.3(GPIO1)
HAND: U40.17(GPIO14)
JOY_B: FPC3.3 H1.2 U40.41(GPIO29_ADC3)
JOY_X: FPC2.1 FPC2.5 FPC3.2 H1.3 U40.40(GPIO28_ADC2)
JOY_Y: FPC2.3 FPC2.7 FPC3.6 H1.4 U40.39(GPIO27_ADC1)
QSPI_CLK: U40.52(QSPI_SCLK) U42.6(CLK)
QSPI_CS: R4.1 R5.1 U40.56(QSPI_SS) U42.1(/CS)
QSPI_IO0: U40.53(QSPI_SD0) U42.5(DI/IO0)
QSPI_IO1: U40.55(QSPI_SD1) U42.2(DO/IO1)
QSPI_IO2: U40.54(QSPI_SD2) U42.3(IO2)
QSPI_IO3: U40.51(QSPI_SD3) U42.7(IO3)
ROW1: D1.1(K) D6.1(K) D11.1(K) D16.1(K) D21.1(K) D26.1(K) D31.1(K) D36.1(K) D41.1(K) U40.27(GPIO16)
ROW2: D2.1(K) D7.1(K) D12.1(K) D17.1(K) D22.1(K) D27.1(K) D32.1(K) D37.1(K) D42.1(K) U40.28(GPIO17)
ROW3: D3.1(K) D8.1(K) D13.1(K) D18.1(K) D23.1(K) D28.1(K) D33.1(K) D38.1(K) D43.1(K) U40.29(GPIO18)
ROW4: D4.1(K) D9.1(K) D14.1(K) D19.1(K) D24.1(K) D29.1(K) D34.1(K) D39.1(K) D44.1(K) U40.30(GPIO19)
ROW5: D5.1(K) D10.1(K) D15.1(K) D20.1(K) D25.1(K) D30.1(K) D35.1(K) D45.1(K) U40.31(GPIO20)
RUN: U40.26(RUN)
SERIAL: CN1.2 U40.2(GPIO0)
USB_D+: D46.2 R1.1 USB1.A6(DP1) USB1.B6(DP2)
USB_D-: D46.1 R2.1 USB1.A7(DN1) USB1.B7(DN2)
XIN: C1.1 U40.20(XIN) U41.1
XOUT: R3.1 U40.21(XOUT)
Net-(C2-2): C2.2 R3.2 U41.3
Net-(D1-2): D1.2(A) U1.1
Net-(D2-2): D2.2(A) U2.1
Net-(D3-2): D3.2(A) U3.1
Net-(D4-2): D4.2(A) U4.1
Net-(D5-2): D5.2(A) U5.1
Net-(D6-2): D6.2(A) U6.1
Net-(D7-2): D7.2(A) U7.1
Net-(D8-2): D8.2(A) U8.1
Net-(D9-2): D9.2(A) U9.1
Net-(D10-2): D10.2(A) U10.1
Net-(D11-2): D11.2(A) U11.1
Net-(D12-2): D12.2(A) U12.1
Net-(D13-2): D13.2(A) U13.1
Net-(D14-2): D14.2(A) U14.1
Net-(D15-2): D15.2(A) U15.1
Net-(D16-2): D16.2(A) U16.1
Net-(D17-2): D17.2(A) U17.1
Net-(D18-2): D18.2(A) U18.1
Net-(D19-2): D19.2(A) U19.1
Net-(D20-2): D20.2(A) U20.1
Net-(D21-2): D21.2(A) U21.1
Net-(D22-2): D22.2(A) U22.1
Net-(D23-2): D23.2(A) U23.1
Net-(D24-2): D24.2(A) U24.1
Net-(D25-2): D25.2(A) U25.1
Net-(D26-2): D26.2(A) U26.1
Net-(D27-2): D27.2(A) U27.1
Net-(D28-2): D28.2(A) U28.1
Net-(D29-2): D29.2(A) U29.1
Net-(D30-2): D30.2(A) U30.1
Net-(D31-2): D31.2(A) U31.1
Net-(D32-2): D32.2(A) U32.1
Net-(D33-2): D33.2(A) U33.1
Net-(D34-2): D34.2(A) U34.1
Net-(D35-2): D35.2(A) U35.1
Net-(D36-2): D36.2(A) U36.1
Net-(D37-2): D37.2(A) U37.1
Net-(D38-2): D38.2(A) U38.1
Net-(D39-2): D39.2(A) SW8.1
Net-(D41-2): D41.2(A) SW3.1
Net-(D42-2): D42.2(A) SW4.1
Net-(D43-2): D43.2(A) SW5.1
Net-(D44-2): D44.2(A) SW6.1
Net-(D45-2): D45.2(A) SW7.1
Net-(F1-2): F1.2 U43.1(VIN)
Net-(LED1-2): LED1.2(DIN) R9.1
Net-(LED1-4): LED1.4(DOUT) LED2.2(DIN)
Net-(LED2-4): LED2.4(DOUT) LED3.2(DIN)
Net-(LED3-4): LED3.4(DOUT) LED4.2(DIN)
Net-(LED4-4): LED4.4(DOUT) LED5.2(DIN)
Net-(LED5-4): LED5.4(DOUT) LED6.2(DIN)
Net-(LED6-4): LED6.4(DOUT) LED8.2(DIN)
Net-(LED8-4): LED8.4(DOUT) LED9.2(DIN)
Net-(LED9-4): LED9.4(DOUT) LED10.2(DIN)
Net-(LED10-4): LED10.4(DOUT) LED11.2(DIN)
Net-(LED11-4): LED11.4(DOUT) LED12.2(DIN)
Net-(LED12-4): LED12.4(DOUT) LED13.2(DIN)
Net-(LED13-4): LED13.4(DOUT) LED14.2(DIN)
Net-(LED14-4): LED14.4(DOUT) LED15.2(DIN)
Net-(LED15-4): LED15.4(DOUT) LED16.2(DIN)
Net-(LED16-4): LED16.4(DOUT) LED17.2(DIN)
Net-(LED17-4): LED17.4(DOUT) LED18.2(DIN)
Net-(LED18-4): LED18.4(DOUT) LED19.2(DIN)
Net-(LED19-4): LED19.4(DOUT) LED20.2(DIN)
Net-(LED20-4): LED20.4(DOUT) LED21.2(DIN)
Net-(LED21-4): LED21.4(DOUT) LED22.2(DIN)
Net-(LED22-4): LED22.4(DOUT) LED23.2(DIN)
Net-(LED23-4): LED23.4(DOUT) LED24.2(DIN)
Net-(LED24-4): LED24.4(DOUT) LED25.2(DIN)
Net-(LED25-4): LED25.4(DOUT) LED26.2(DIN)
Net-(LED26-4): LED26.4(DOUT) LED27.2(DIN)
Net-(LED27-4): LED27.4(DOUT) LED28.2(DIN)
Net-(LED28-4): LED28.4(DOUT) LED29.2(DIN)
Net-(LED29-4): LED29.4(DOUT) LED30.2(DIN)
Net-(LED30-4): LED30.4(DOUT) LED31.2(DIN)
Net-(LED31-4): LED31.4(DOUT) LED32.2(DIN)
Net-(LED32-4): LED32.4(DOUT) LED33.2(DIN)
Net-(LED33-4): LED33.4(DOUT) LED34.2(DIN)
Net-(LED34-4): LED34.4(DOUT) LED35.2(DIN)
Net-(LED35-4): LED35.4(DOUT) LED36.2(DIN)
Net-(LED36-4): LED36.4(DOUT) LED37.2(DIN)
Net-(LED37-4): LED37.4(DOUT) LED38.2(DIN)
Net-(LED38-4): LED38.4(DOUT) LED39.2(DIN)
Net-(LED39-4): LED39.4(DOUT) LED40.2(DIN)
Net-(LED40-4): LED40.4(DOUT) LED41.2(DIN)
Net-(LED41-4): LED41.4(DOUT) LED42.2(DIN)
Net-(LED42-4): LED42.4(DOUT) LED43.2(DIN)
Net-(LED43-4): LED43.4(DOUT) LED44.2(DIN)
Net-(LED44-4): LED44.4(DOUT) LED45.2(DIN)
Net-(R1-2): R1.2 U40.47(USB_DP)
Net-(R2-2): R2.2 U40.46(USB_DM)
Net-(R4-2): R4.2 SW1.2
Net-(R7-2): R7.2 USB1.A5(CC1)
Net-(R8-2): R8.2 USB1.B5(CC2)

Not connected (* = marked no-connect by the designer): FPC3 1*; LED45 4(DOUT)*; U40 11(GPIO8)* 12(GPIO9)* 13(GPIO10)* 14(GPIO11)* 18(GPIO15)* 24(SWCLK)* 25(SWD)* 32(GPIO21)* 34(GPIO22)* 35(GPIO23)* 37(GPIO25)* 38(GPIO26_ADC0)*; U43 4(NC)*; USB1 A8(SBU1)* B8(SBU2)*

## Notes on the sheets
sheet 1
- RP2040
- USB-C Connector, Power Input, ESD
- GND
- 3V3 LDO
- Alps Connector
- PSP 3000 Connector
- Joystick Solder Pads
- Filter Caps
- Reset Button
- Split Serial Port
- Crystal
- QSPI Flash
